# EAGLE design main (EAGLE 6.0)
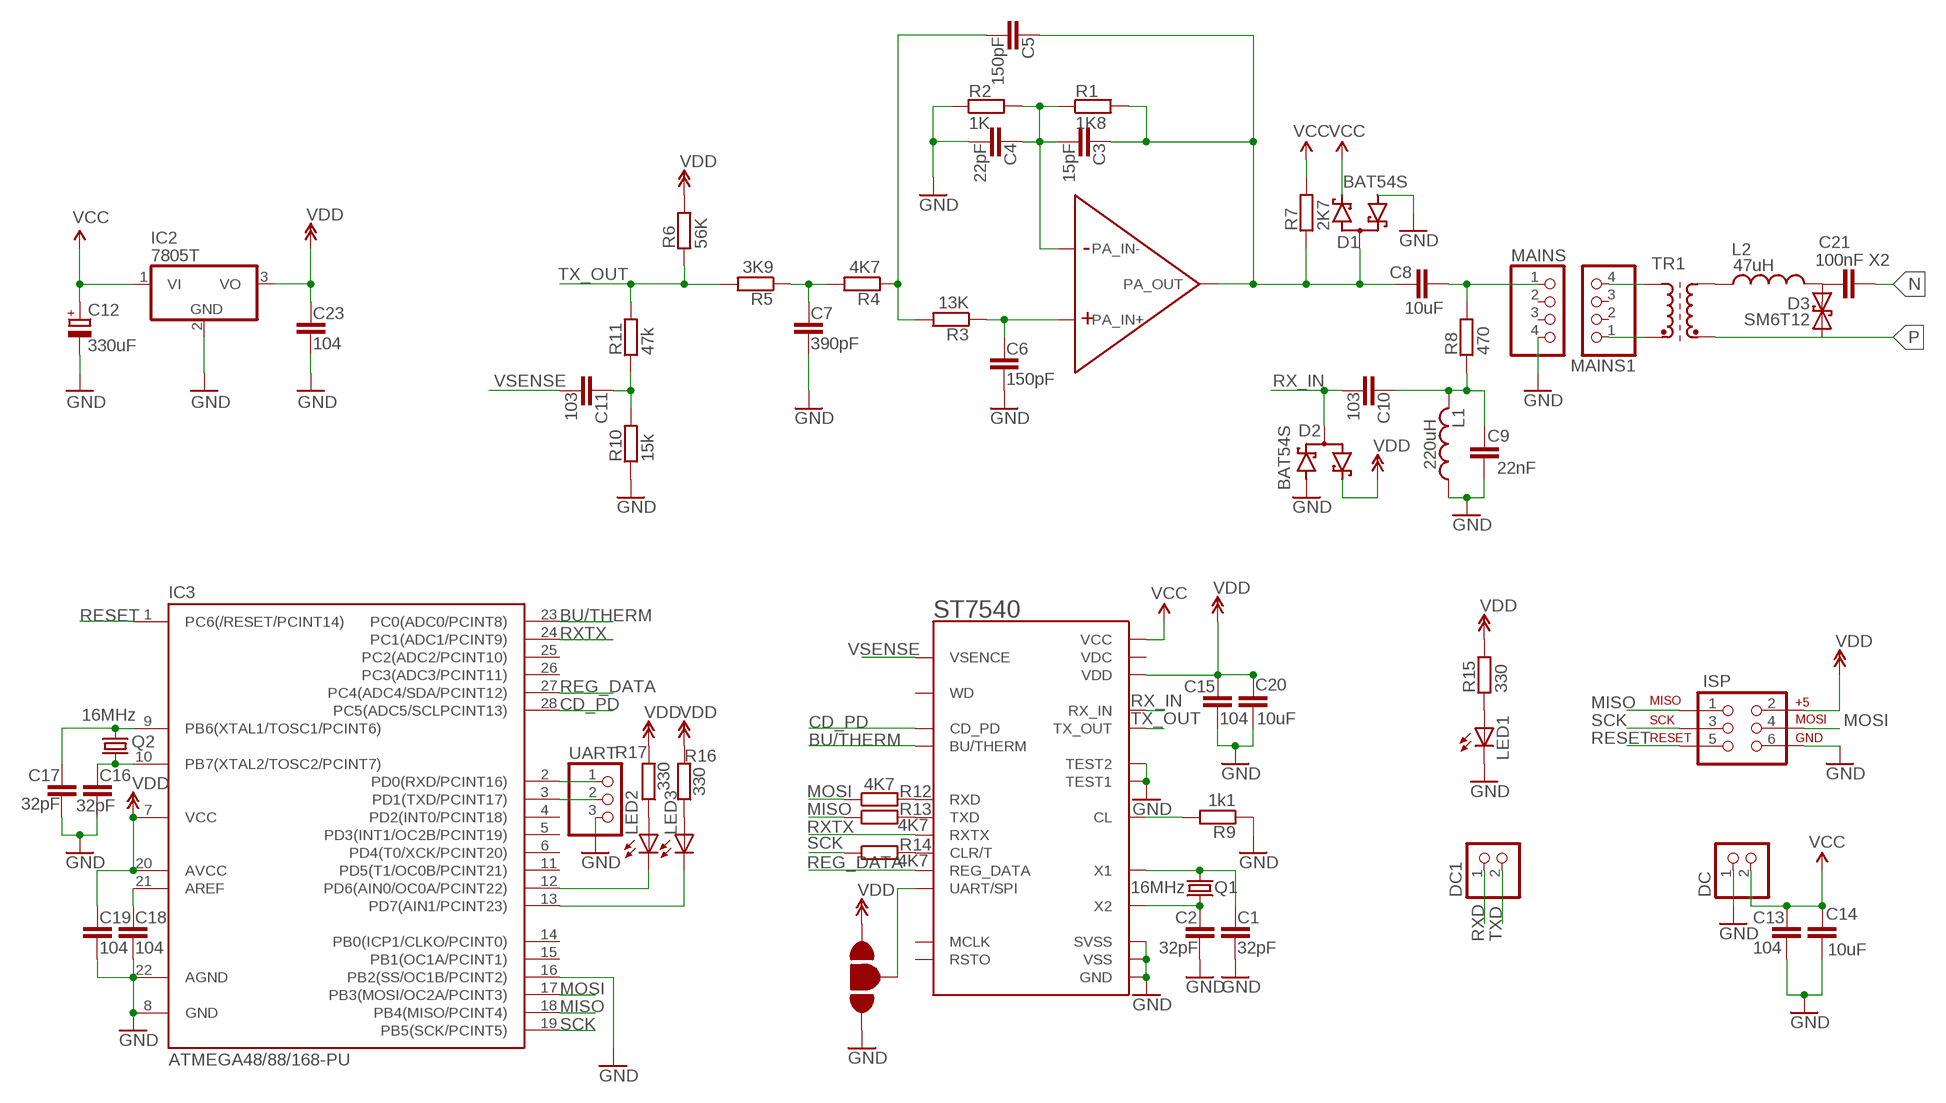
[diagram p0: schematic, sheet 1]

## Parts
C1  32pF  CC-22X55(FAKI)  [C-22X55(FAKI)]
C2  32pF  CC-22X55(FAKI)  [C-22X55(FAKI)]
C3  15pF  CC-22X55(FAKI)  [C-22X55(FAKI)]
C4  22pF  CC-22X55(FAKI)  [C-22X55(FAKI)]
C5  150pF  CC-22X55(FAKI)  [C-22X55(FAKI)]
C6  150pF  CC-25X8(FAKI)  [C-25X8(FAKI)]
C7  390pF  CC-25X8(FAKI)  [C-25X8(FAKI)]
C8  10uF  CC-25X8(FAKI)  [C-25X8(FAKI)]
C9  22nF  CC-22X6(FAKI)  [C-22X6(FAKI)]
C10  103  CC-25X8(FAKI)  [C-25X8(FAKI)]
C11  103  CC-25X8(FAKI)  [C-25X8(FAKI)]
C12  330uF  CPOL-EUTT2D6  [TT2D6]
C13  104  CC-22X6(FAKI)  [C-22X6(FAKI)]
C14  10uF  CC-22X55(FAKI)  [C-22X55(FAKI)]
C15  104  CC-22X6(FAKI)  [C-22X6(FAKI)]
C16  32pF  CC-22X55(FAKI)  [C-22X55(FAKI)]
C17  32pF  CC-22X55(FAKI)  [C-22X55(FAKI)]
C18  104  CC-22X6(FAKI)  [C-22X6(FAKI)]
C19  104  CC-22X6(FAKI)  [C-22X6(FAKI)]
C20  10uF  CC-22X55(FAKI)  [C-22X55(FAKI)]
C21  100nF X2  CC-22X6(FAKI)  [C-22X6(FAKI)]
C23  104  CC-22X55(FAKI)  [C-22X55(FAKI)]
D1  BAT54S  [SOT23]
D2  BAT54S  [SOT23]
D3  SM6T12  BZW04XXB  [F126Z12]
DC  PINHD-1X2  [1X02]
DC1  PINHD-1X2  [1X02]
IC1  ST7540BREAKOUT  [ST7540-BREAKOUT]
IC2  7805T  [TO220H]
IC3  ATMEGA48/88/168-PU  [DIL28-3]
ISP  AVR-ISP-6  [AVR-ISP-6]
JP2  PCB-JUMPER-3  [PCB-JUMPER-3]
L1  220uH  LDIP  [L-2.2MH-DIP]
L2  47uH  LDIP  [L-2.2MH-DIP]
LED1  LED3MM  [LED3MM]
LED2  LED3MM  [LED3MM]
LED3  LED3MM  [LED3MM]
MAINS  PINHD-1X4  [1X04]
MAINS1  PINHD-1X4  [1X04]
Q1  16MHz  CRYSTALHC49US  [HC49US]
Q2  16MHz  CRYSTALHC49US  [HC49US]
R1  1K8  R0207/12  [R0207/12]
R2  1K  R0207/12  [R0207/12]
R3  13K  R0207/12  [R0207/12]
R4  4K7  R0207/12  [R0207/12]
R5  3K9  R0207/12  [R0207/12]
R6  56K  R0207/12  [R0207/12]
R7  2K7  R0207/12  [R0207/12]
R8  470  R0207/12  [R0207/12]
R9  1k1  R0207/12  [R0207/12]
R10  15k  R0207/12  [R0207/12]
R11  47k  R0207/12  [R0207/12]
R12  4K7  R0207/10  [R0270/10]
R13  4K7  R0207/10  [R0270/10]
R14  4K7  R0207/10  [R0270/10]
R15  330  R0207/10  [R0270/10]
R16  330  R0207/10  [R0270/10]
R17  330  R0207/10  [R0270/10]
TR1  SM-T4  [SM-T4]
UART  PINHD-1X3  [1X03]

## Nets
12V: C15.1 C19.1 C20.1 C23.1 D2.2(C2) IC1.VDD IC2.3(VO) IC3.7(VCC) IC3.20(AVCC) ISP.2 JP2.P$1 R6.2 R15.2 R16.2 R17.2 ; supply symbol labelled VDD
BU/THERM: IC1.BU/THERM IC3.23(PC0(ADC0/PCINT8))
CD_PD: IC1.CD_PD IC3.28(PC5(ADC5/SCLPCINT13))
GND: C1.2 C2.2 C4.2 C6.2 C7.2 C9.1 C12.- C13.2 C14.2 C15.2 C16.2 C17.2 C18.2 C19.2 C20.2 C23.2 D1.1(A1) D2.1(A1) DC.1 IC1.GND IC1.SVSS IC1.TEST1 IC1.TEST2 IC1.VSS IC2.2(GND) IC3.8(GND) IC3.16(PB2(SS/OC1B/PCINT2)) IC3.22(AGND) ISP.6 JP2.P$3 L1.P$1 LED1.K(C) MAINS.4 R2.1 R9.1 R10.1 UART.3
MISO: IC3.18(PB4(MISO/PCINT4)) ISP.1 R13.1
MOSI: IC3.17(PB3(MOSI/OC2A/PCINT3)) ISP.4 R12.1
N: C21.1
N$1: C1.1 IC1.X1 Q1.1
N$2: C2.1 IC1.X2 Q1.2
N$3: C3.1 C5.1 C8.1 D1.3(C1A2) IC1.PA_OUT R1.2 R7.1
N$4: C3.2 C4.1 IC1.PA_IN- R1.1 R2.2
N$5: C5.2 R3.2 R4.1
N$6: C6.1 IC1.PA_IN+ R3.1
N$7: C8.2 MAINS.1 R8.2
N$8: C7.1 R4.2 R5.1
N$9: C9.2 C10.1 L1.P$2 R8.1
N$10: C11.1 R10.2 R11.1
N$11: IC1.CL R9.2
N$12: IC1.UART/SPI JP2.P$2
N$13: C16.1 IC3.10(PB7(XTAL2/TOSC2/PCINT7)) Q2.2
N$14: C17.1 IC3.9(PB6(XTAL1/TOSC1/PCINT6)) Q2.1
N$16: MAINS1.4 TR1.1(A1)
N$17: MAINS1.1 TR1.2(E1)
N$18: IC1.CLR/T R14.2
N$19: C18.1 IC3.21(AREF)
N$21: LED1.A R15.1
N$22: IC3.12(PD6(AIN0/OC0A/PCINT22)) LED2.K(C)
N$23: IC3.13(PD7(AIN1/PCINT23)) LED3.K(C)
N$24: LED2.A R17.1
N$25: LED3.A R16.1
N$26: L2.P$1 TR1.5(A2)
N$28: C21.2 D3.C L2.P$2
P: D3.A TR1.4(E2)
REG_DATA: IC1.REG_DATA IC3.27(PC4(ADC4/SDA/PCINT12))
RESET: IC3.1(PC6(/RESET/PCINT14)) ISP.5
RX_IN: C10.2 D2.3(C1A2) IC1.RX_IN
RXD: DC1.1 IC1.RXD IC3.2(PD0(RXD/PCINT16)) R12.2 UART.1
RXTX: IC1.RXTX IC3.24(PC1(ADC1/PCINT9))
SCK: IC3.19(PB5(SCK/PCINT5)) ISP.3 R14.1
TX_OUT: IC1.TX_OUT R5.2 R6.1 R11.2
TXD: DC1.2 IC1.TXD IC3.3(PD1(TXD/PCINT17)) R13.2 UART.2
VCC: C12.+ C13.1 C14.1 D1.2(C2) DC.2 IC1.VCC IC2.1(VI) R7.2
VSENSE: C11.2 IC1.VSENSE(VSENCE)
Unconnected: IC1.MCLK IC1.RSTO IC1.VDC IC1.WD IC3.4(PD2(INT0/PCINT18)) IC3.5(PD3(INT1/OC2B/PCINT19)) IC3.6(PD4(T0/XCK/PCINT20)) IC3.11(PD5(T1/OC0B/PCINT21)) IC3.14(PB0(ICP1/CLKO/PCINT0)) IC3.15(PB1(OC1A/PCINT1)) IC3.25(PC2(ADC2/PCINT10)) IC3.26(PC3(ADC3/PCINT11)) MAINS1.2 MAINS1.3 MAINS.2 MAINS.3

## Library data of the parts
C1-C11 C13-C21 C23 = candrian:C
C12 = rcl:CPOL-EU: POLARIZED CAPACITOR, European symbol
D1 D2 = candrian:BAT54S: Low drop schottky diode
D3 = diode:BZW04XXB: DIODE uni and bidirectional supressor diode
DC DC1 = pinhead:PINHD-1X2: PIN HEADER
IC1 = candrian:ST7540
IC2 = linear:78*: Positive VOLTAGE REGULATOR Source: http://cache.national.com/ds/LM/LM78L05.pdf http://www.fairchildsemi.com/ds/LM/LM7805.pdf
IC3 = atmega8:ATMEGA48/88/168-PU
ISP = candrian:AVR-ISP-6
JP2 = candrian:PCB-JUMPER-3
L1 L2 = candrian:L
LED1-LED3 = candrian:LED: LED Through-hole
MAINS MAINS1 = pinhead:PINHD-1X4: PIN HEADER
Q1 Q2 = candrian:CRYSTAL
R1-R17 = candrian:R
TR1 = inductor-neosid:SM-T4: TRANSFORMER SMD wideband transformer; OC_FARNELL: unknown; OC_NEWARK: unknown
UART = pinhead:PINHD-1X3: PIN HEADER

## Board
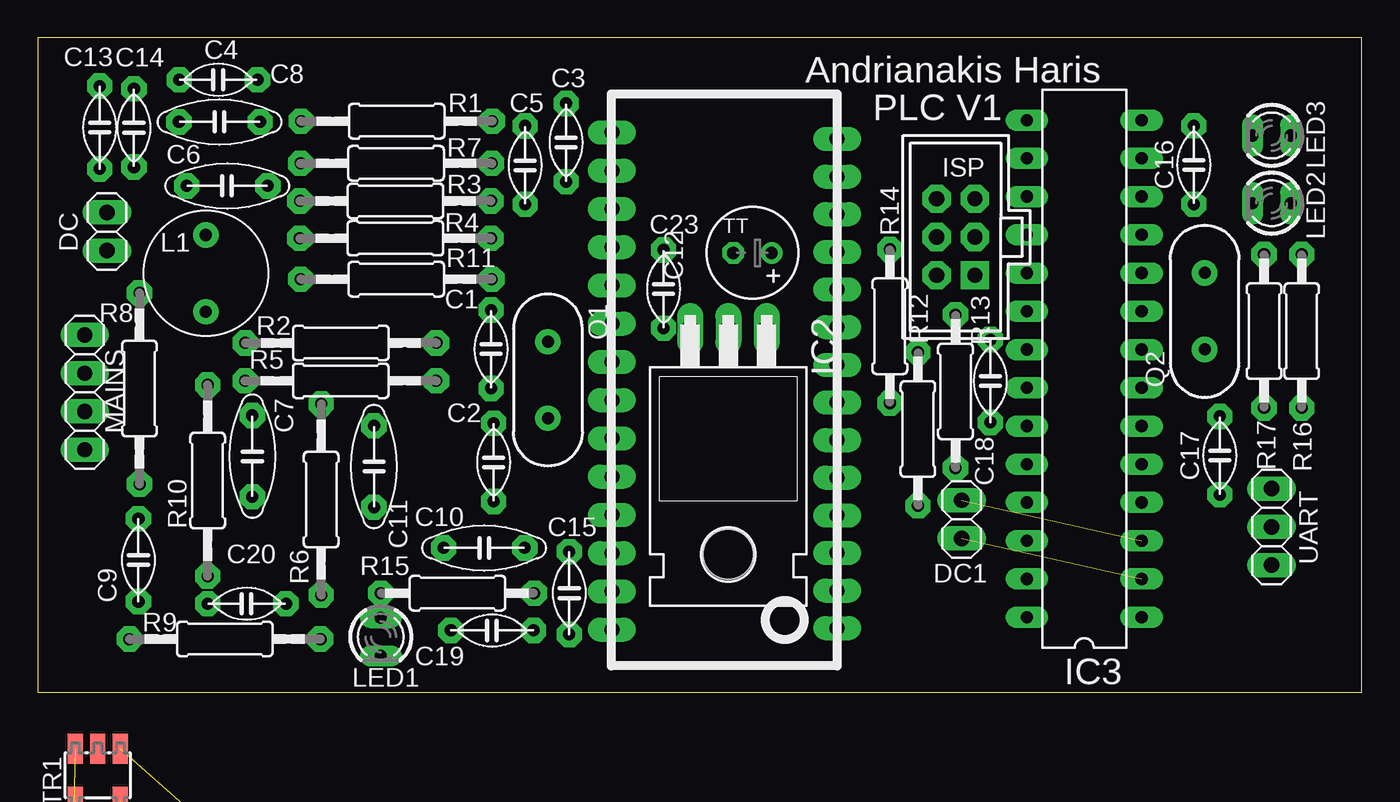
[diagram p1: board, top side]
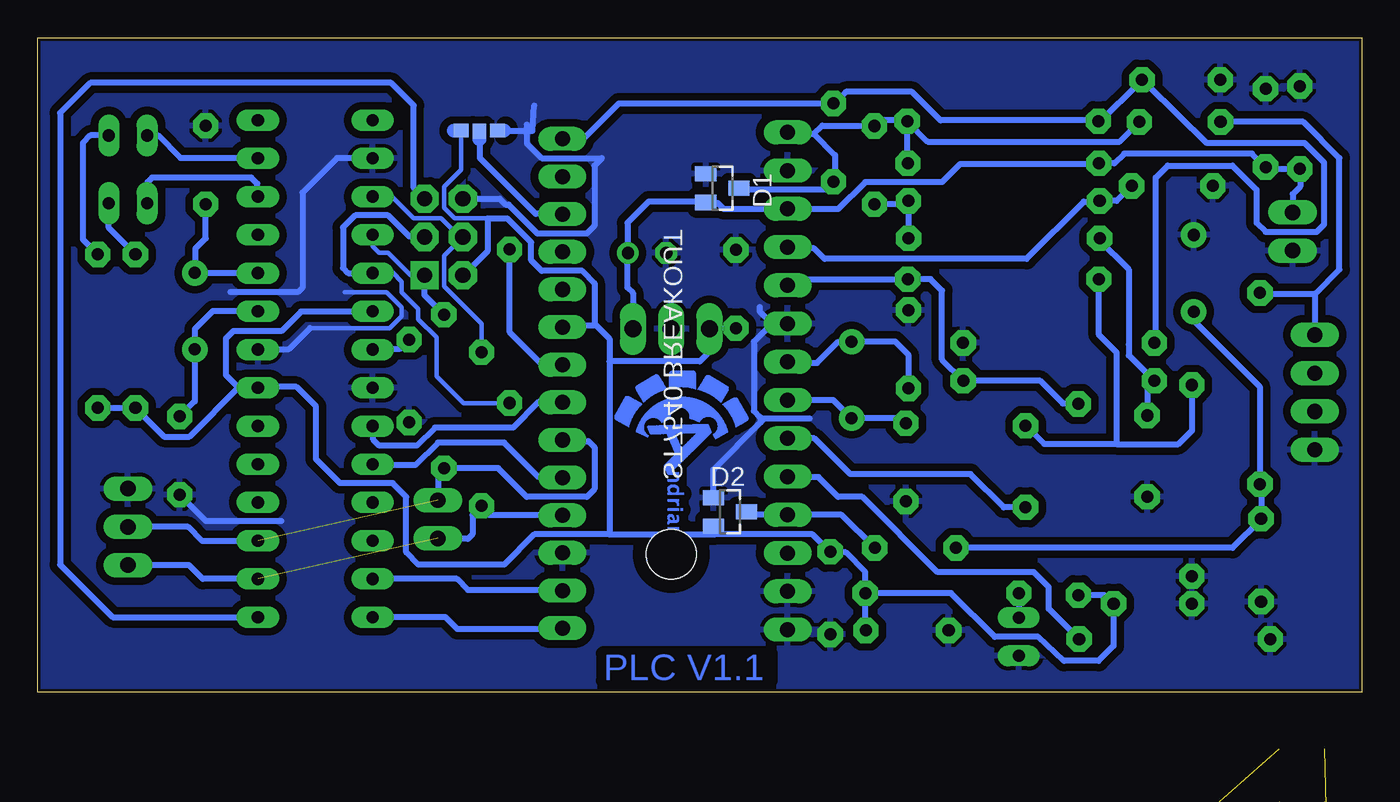
[diagram p2: board, bottom side, seen from below]

Size 88 x 43.5 mm. Coordinates in mm from the lower left corner, seen from the top.
Outline: 0,0 88,0 88,43.5 0,43.5 0,0
Copper layers (1*16): Top 0.035mm / dielectric 1.5mm / Bottom 0.035mm
Design rules: minimum track width 8mil, minimum drill 0.3mm, track to track 0.5mm, track to pad 0.5mm, pad to pad 0.5mm, via to via 0.2mm, smd to smd 0.2mm, copper to edge 8mil, drill to drill 8mil, minimum pad ring 12mil, minimum via ring 10mil, stop-mask expansion 4mil, vias tented up to drill 25mil, thermal gap 10mil

### Footprints (pad centres in the part's own frame; a part is rotated, then mirrored left to right if it is on the bottom)
C-22X55(FAKI) = drill 0.8 pad 1.676 octagon: 1 -2.6,0; 2 2.6,0
C-25X8(FAKI) = drill 0.8 pad 1.676 octagon: 1 -2.7,0; 2 2.7,0
C-22X6(FAKI) = drill 0.8 pad 1.676 octagon: 1 -2.75,0; 2 2.75,0
TT2D6 = drill 0.813: + -1.27,0 | drill 0.813 octagon: - 1.27,0
SOT23 = smd 1 x 1.4: 1 -0.95,-1.1; 2 0.95,-1.1; 3 0,1.1
F126Z12 = drill 1.016 long: A 6.35,0; C -6.35,0
1X02 = drill 1.016 long: 1 -1.27,0; 2 1.27,0
ST7540-BREAKOUT = drill 1 long: BU/THERM -7.89,2.72; CD_PD -7.89,17.72; CL 7.08,7.65; CLR/T -7.89,0.22; GND -7.89,12.72; MCLK -7.89,-4.78; PA_IN+ 7.08,-7.59; PA_IN- -7.89,-14.78; PA_OUT 7.08,-15.21; REG_DATA -7.89,15.22; RSTO -7.89,-7.28; RX_IN 7.08,10.19; RXD -7.89,10.22; RXTX -7.89,7.72; SVSS 7.08,-2.51; TEST1 7.08,15.27; TEST2 7.08,17.81; TX_OUT 7.08,-5.05; TXD -7.89,5.22; UART/SPI -7.89,-9.78; VCC 7.08,-10.13; VDC 7.08,12.73; VDD -7.89,-2.28; VSENSE 7.08,5.11; VSS 7.08,-12.67; WD -7.89,-12.28; X1 7.08,0.03; X2 7.08,2.57
TO220H = drill 1.118 long: 1 -2.54,-10.16; 2 0,-10.16; 3 2.54,-10.16 | hole 3.302: 0,4.826
DIL28-3 = drill 0.813 long: 1 -16.51,-3.81; 2 -13.97,-3.81; 3 -11.43,-3.81; 4 -8.89,-3.81; 5 -6.35,-3.81; 6 -3.81,-3.81; 7 -1.27,-3.81; 8 1.27,-3.81; 9 3.81,-3.81; 10 6.35,-3.81; 11 8.89,-3.81; 12 11.43,-3.81; 13 13.97,-3.81; 14 16.51,-3.81; 15 16.51,3.81; 16 13.97,3.81; 17 11.43,3.81; 18 8.89,3.81; 19 6.35,3.81; 20 3.81,3.81; 21 1.27,3.81; 22 -1.27,3.81; 23 -3.81,3.81; 24 -6.35,3.81; 25 -8.89,3.81; 26 -11.43,3.81; 27 -13.97,3.81; 28 -16.51,3.81
AVR-ISP-6 = drill 1.016 pad 1.88 square: 1 -2.54,-1.27 | drill 1.016 pad 1.88 octagon: 2 -2.54,1.27; 3 0,-1.27; 4 0,1.27; 5 2.54,-1.27; 6 2.54,1.27
PCB-JUMPER-3 = smd 1 x 0.9 bottom: P$1 -1.23,0.2; P$3 1.2,0.2 | smd 0.9 x 1 bottom: P$2 0,0.24
L-2.2MH-DIP = drill 0.8 pad 1.676: P$1 -2.55,0; P$2 2.55,0
LED3MM = drill 0.8 long: A -1.27,0; K 1.27,0
1X04 = drill 1.016 long: 1 -3.81,0; 2 -1.27,0; 3 1.27,0; 4 3.81,0
HC49US = drill 0.8 pad 1.676: 1 -2.54,0; 2 2.54,0
R0207/12 = drill 0.8 pad 1.676 octagon: 1 -6.35,0; 2 6.35,0
R0270/10 = drill 0.8 pad 1.676 octagon: 1 -5.1,0; 2 5.1,0
SM-T4 = smd 1 x 2: 1 -1.5,-1.75; 2 -1.5,1.75; 3 0,1.75; 4 1.5,1.75; 5 1.5,-1.75
1X03 = drill 1.016 long: 1 -2.54,0; 2 0,0; 3 2.54,0

### Placement (x,y rotation side)
C1  30.13,22.8 90 top
C2  30.3,15.29 270 top
C3  35.12,36.53 90 top
C4  12.01,40.7 180 top
C5  32.4,35.03 270 top
C6  12.6,33.65 180 top
C7  14.27,15.7 270 top
C8  12.09,37.9 180 top
C9  6.7,8.79 90 top
C10  29.67,9.6 0 top
C11  22.35,15.01 270 top
C12  47.5,29.2 180 top
C13  4.12,37.53 90 top
C14  6.4,37.5 90 top
C15  35.33,6.6 270 top
C16  76.83,35.04 90 top
C17  78.56,15.74 270 top
C18  63.31,20.69 270 top
C19  30.21,4.12 180 top
C20  13.9,5.9 180 top
C21  4,-27.5 0 top  (outside the outline)
C23  41.6,26.8 90 top
D1  42.5,33.5 270 bottom
D2  42,12 270 bottom
D3  8.5,-12 0 top  (outside the outline)
DC  4.6,30.62 90 top
DC1  61.4,11.5 90 top
IC1  45.24,21.99 180 top
IC2  45.9,14 180 top
IC3  69.55,21.51 90 top
ISP  61.01,30.26 90 top
JP2  58.64,37.52 180 top
L1  11.18,27.84 270 top
L2  4.5,-20 0 top  (outside the outline)
LED1  22.8,3.7 270 top
LED2  82,32.5 180 top
LED3  82,37 180 top
MAINS  3.13,19.94 270 top
MAINS1  5.5,-34.5 0 top  (outside the outline)
Q1  33.91,20.75 270 top
Q2  77.55,25.33 90 top
R1  23.86,37.95 0 top
R2  20.15,23.22 180 top
R3  23.78,32.65 0 top
R4  23.77,30.17 180 top
R5  20.14,20.7 0 top
R6  18.84,12.82 270 top
R7  23.82,35.15 180 top
R8  6.77,20.19 90 top
R9  12.44,3.55 0 top
R10  11.3,14.07 90 top
R11  23.83,27.46 0 top
R12  58.5,17.5 270 top
R13  61,20 270 top
R14  56.63,24.33 90 top
R15  27.9,6.6 0 top
R16  84,24 270 top
R17  81.5,24 270 top
TR1  4,-5.5 0 top  (outside the outline)
U$1  [CANDRIAN-LOGO/SMALL/BOTTOM]  45.3,16.9 90 top
UART  82,11 90 top

### Tracks (layer width: path | path; a pad name or v marks a point on that pad's centre or on a via)
12V
  Bottom 0.305: 58.1,31.5 60.3,31.5 61,32.2 61,33.6 59.87,34.73 JP2.P$1
  Bottom 0.406: R16.2 R17.2 79.6,17 77.9,17 74.6,20.3 | 72.42,20.3 74.6,20.3 | IC3.7 72.42,20.3 | IC3.20 65.76,25.3 70.5,25.3 71.8,24 75,24 75.5,23.5 75.5,21.1 74.7,20.3 74.6,20.3 | 50,10.5 55,10.5 57,8.5 62.7,8.5 63.5,9.3 63.5,13 64.4,13.9 67.9,13.9 69.5,15.5 69.5,19 70.8,20.3 72.42,20.3 | 43,10.5 36.5,10.5 35.35,9.35 C15.1 35.38,9.3 | 43,10.5 43.1,10.6 D2.2 | 51,24.4 53.2,24.4 53.13,24.33 IC1.VDD | 51,24.4 50.9,24.4 50,23.5 50,22 | 50,22 50,10.5 | 50,10.5 43,10.5 | C19.1 33,4.16 R15.2 | 16.5,5.8 16.48,5.8 17.14,6.46 R6.2 | 16.5,5.8 16.5,3.1 17.5,2.1 19.8,2.1 21.5,3.7 24.4,3.7 27.3,6.6 R15.2 | 51,24.4 51,27.2 51.8,28 54.5,28 55.2,28.7 55.2,29.9 56.8,31.5 58.1,31.5 58.1,29.3 59.68,27.72 ISP.2 | R15.2 33,8 34.3,9.3 35.38,9.3 | 35.38,9.3 35.4,9.3 | C23.1 42.76,24.16 IC2.3 43.5,24.02 43.5,22.5 44,22 50,22 | 16.5,5.8 C20.1
BU/THERM
  Bottom 0.406: IC3.23 65.7,17.7 65.7,16.8 65.3,16.4 62.8,16.4 61.6,17.6 56.4,17.6 54.7,19.3 53.16,19.3 IC1.BU/THERM
CD_PD
  Bottom 0.406: IC1.CD_PD 53.2,4.2 60.1,4.2 60.9,5 IC3.28 66,5
GND
  Bottom 0.305: 69.9,24.2 64.6,24.2 63.8,25 63.8,25.6 64.8,26.6 | 64.8,26.6 65.4,26.6 | 64.8,26.6 67.6,26.6
  Bottom 0.406: ISP.6 57.3,32.8 56.9,32.4 56.7,32.4 54.8,30.5 51.5,30.5 51,31 51,35 50.5,35.5 54.5,35.5 55.5,36.5 55.5,37.72 55.12,37.3 | JP2.P$3 55.12,37.3 | 55.12,37.3 55,39 | IC3.8 73.34,22.8 71.3,22.8 69.9,24.2 | D2.1 43.1,14.8 39.95,17.95 | 39.95,17.95 39.7,18.2 36.7,18.2 | IC1.SVSS 39.2,24.5 | 39.2,24.5 40,25.3 40,25.6 | 39.2,24.5 40.4,23.3 40.4,18.7 39.95,18.25 39.95,17.95 | C17.2 76.82,11.4 71.8,11.4 | IC3.16 65.82,35.4 66,35.4 66.1,35.5 68.1,35.5 70.4,33.2 70.4,26.9 70.7,26.6 75.2,26.6
  pour Bottom: 0,43.5 88,43.5 88,0 0,0
MISO
  Bottom 0.305: IC3.18 65.74,29.64 65.3,29.2 64.76,29.2 64.7,29.2 63.2,27.7 62.3,27.7
  Bottom 0.406: R13.1 62.3,26.4 62.3,27.7 ISP.1
MOSI
  Bottom 0.305: IC3.17 65.76,32.94 65.8,32.9 64.4,32.9 63,31.5 61.5,31.5 61.28,31.5 61.2,31.5 59.9,30.2 59.8,30.2 ISP.4 61,29 61,27 58.5,24.5 R12.1
N$1
  Bottom 0.406: IC1.X1 38.1,21.9 36.2,21.9 34.81,23.29 Q1.1 33.22,23.29 33.21,23.3 31,23.3 30.1,22.4 30.1,20.2 C1.1
N$2
  Bottom 0.406: C2.1 30.62,18.21 Q1.2 35.12,19.42 IC1.X2
N$3
  Bottom 0.406: IC1.PA_OUT 38.06,37.1 36.4,37.1 | 36.4,37.1 35.85,37.65 32.42,37.65 | D1.3 41.4,33.6 41.1,33.4 35.6,33.4 35.05,33.95 | R7.1 30.21,35.19 R1.2 | 32.42,37.65 C5.1 32.4,37.7 32.3,37.7 32,38 30.26,38 R1.2 | 36.4,37.1 35,35.7 35,34 35.05,33.95 | C3.1 35.04,33.95 35.05,33.95 | R1.2 28.86,36.6 16.09,36.6 C8.1 | 32.42,37.65 32.47,37.7 32.5,37.7
N$4
  Bottom 0.406: IC1.PA_IN- 51.73,36.77 49.37,39.13 C3.2 35.1,39.11 35.1,39.1 34.3,39.9 29.9,39.9 28,38 17.51,38 | 17.56,38 R1.1 17.5,38 17.51,38 | 17.51,38 17.6,38.1 17.1,38.2 15.1,40.2 C4.1 14.5,40.59 14.2,40.3 10.3,36.5 3.8,36.5 2.5,35.2 2.5,31.1 3,30.6 6.4,30.6 7,31.2 7,33.4 8.6,35 12.9,35 13.7,34.2 13.7,23.32 R2.2
N$5
  Bottom 0.406: R4.1 R3.2 30.35,32.43 C5.2
N$6
  Bottom 0.406: IC1.PA_IN+ 38.08,29.58 38,29.5 36.4,29.5 35.7,28.8 22.28,28.8 18.48,32.6 17.5,32.6 17.45,32.65 R3.1 16.3,32.65 C6.1
N$7
  Bottom 0.406: 6.77,26.39 R8.2 | R8.2 6.73,26.5 3.1,26.5 | 3.1,26.5 1.5,28.1 1.5,35.5 3.9,37.9 C8.2 | 6.8,26.51 R8.2 | 3.1,26.5 3.13,26.47 MAINS.1
N$8
  Bottom 0.406: R4.2 17.42,30.08 17.5,30.1 15.5,28.1 15.5,23.1 15.49,22.39 R5.1 14.27,20.22 C7.1
N$9
  Bottom 0.406: 27,9.6 C10.1 8.6,9.6 6.7,11.5 C9.2 6.7,13.6 6.8,13.7 6.8,13.8 6.8,13.81 | L1.P$2 11.18,24.69 6.8,20.31 6.8,13.81 | R8.1 6.8,13.81
N$10
  Bottom 0.406: R11.1 17.5,26.98 17.5,23.8 16.3,22.6 16.3,16.5 | R10.2 11.3,17.4 12.2,16.5 16.3,16.5 | 16.3,16.5 21.1,16.5 22.31,17.71 C11.1
N$11
  Bottom 0.406: R9.2 20.8,5.56 20.8,7 21.8,8 28.2,8 33.2,13 34.8,13 36.1,14.3 38.12,14.3 | 38.12,14.3 38.2,14.3 | IC1.CL 38.12,14.3
N$12
  Bottom 0.305: 58.7,36.7 58.7,37.3 58.66,37.3 JP2.P$2
  Bottom 0.406: IC1.UART/SPI 53.16,31.8 54.9,31.8 58.6,35.5 58.6,36.6 58.7,36.7
N$13
  Bottom 0.406: IC3.10 73.38,27.84 77.57,27.84 Q2.2 | Q2.2 77.5,27.92 77.5,29.5 76.83,30.17 C16.1 | Q2.2
N$14
  Bottom 0.406: IC3.9 76.36,25.33 77.55,24.14 Q2.1 77.55,19.34 78.56,18.33 C17.1
N$16  (1 unrouted)
N$17  (1 unrouted)
N$18
  Bottom 0.406: IC1.CLR/T 53.16,21.8 54.5,21.8 56.63,23.93 R14.2
N$19
  Bottom 0.406: C18.1 63.95,22.8 65.8,22.8 65.78,22.78 IC3.21
N$21
  Bottom 0.406: R15.1 LED1.A
N$22
  Bottom 0.406: IC3.12 73.4,32.9 73.4,33.8 73.8,34.2 80.4,34.2 80.7,33.9 80.7,32.4 LED2.K
N$23
  Bottom 0.406: IC3.13 73.38,35.5 78.5,35.5 80,37 LED3.K
N$24
  Bottom 0.406: R17.1 83.27,30.87 LED2.A
N$25
  Bottom 0.406: LED3.A 84.5,37 85,36.5 85,30.1 R16.1
N$26  (1 unrouted)
N$28  (2 unrouted)
P  (1 unrouted)
REG_DATA
  Bottom 0.406: IC1.REG_DATA 53.16,6.8 59.4,6.8 60.14,7.54 IC3.27
RESET
  Bottom 0.406: ISP.5 63,33.52 63,39 64.5,40.5 84.5,40.5 86.5,38.5 86.5,8.5 83,5 IC3.1
RX_IN
  Bottom 0.406: IC1.RX_IN 41.16,11.8 41.36,12 D2.3 | C10.2 34.57,11.8 IC1.RX_IN | IC1.RX_IN 38.2,11.8
RXD  (1 unrouted)
  Bottom 0.406: 58.5,12.3 58,11.8 53.1,11.8 IC1.RXD | 58.5,12.3 R12.2 58.5,12.5 | 58.5,12.3 59.1,11.8 59.1,10.5 59.4,10.2 61.4,10.2 DC1.1 | DC1.1 | IC3.2 77.03,7.55 77.94,8.46 UART.1
RXTX
  Bottom 0.406: 65.88,15.1 62.9,15.1 61.4,16.6 57,16.6 54.7,14.3 53.16,14.3 IC1.RXTX | IC3.24 65.88,15.1 | 65.88,15.1 65.9,15.2
SCK
  Bottom 0.305: R14.1 56.66,19.2 59.7,19.2 61.5,21 61.5,23.6 62.7,24.8 62.7,25.5 63.8,26.6 63.8,27.3 64.4,27.9 65.7,27.9
  Bottom 0.406: ISP.3 62.32,30.3 63.3,30.3 64.7,31.7 66.9,31.7 67.7,30.9 67.7,28.2 67.36,27.86 IC3.19 65.7,27.9
TX_OUT
  Bottom 0.406: IC1.TX_OUT 37.74,27.46 R11.2 28.66,27.46 27.9,26.7 27.9,22.11 R5.2 21.38,20.7 19.88,19.2 18.88,19.2 R6.1
TXD  (1 unrouted)
  Bottom 0.406: IC1.TXD 53.06,16.7 51.4,16.7 51,16.3 51,13.5 51.5,13 55.5,13 57.4,14.9 60.9,14.9 61,15 R13.2 61.4,14.5 DC1.2 | IC3.3 73.39,10.05 77.05,10.05 78,11 UART.2
VCC
  Bottom 0.406: IC1.VCC 38.18,32.1 | 38.18,32.1 42.4,32.1 42.8,32.5 43.55,32.5 D1.2 43.65,32.6 47.4,32.6 48.8,31.2 48.8,29.23 C12.+ 48.8,29.2 48.8,26.9 48.44,26.54 IC2.1 | 38.18,32.1 34.8,32.1 33,33.9 27.9,33.9 26.7,35.1 17.52,35.1 R7.2 16.45,35.15 15.8,35.8 7.3,35.8 C14.1 6.28,34.78 C13.1 4.1,34.76 4.1,33.6 4.6,33.1 DC.2
VSENSE
  Bottom 0.406: C11.2 23.8,12.3 26,14.5 34,14.5 36.38,16.88 IC1.VSENSE

### Text on the board
Bottom: PLC V1.1
tNames: Andrianakis Haris | PLC V1